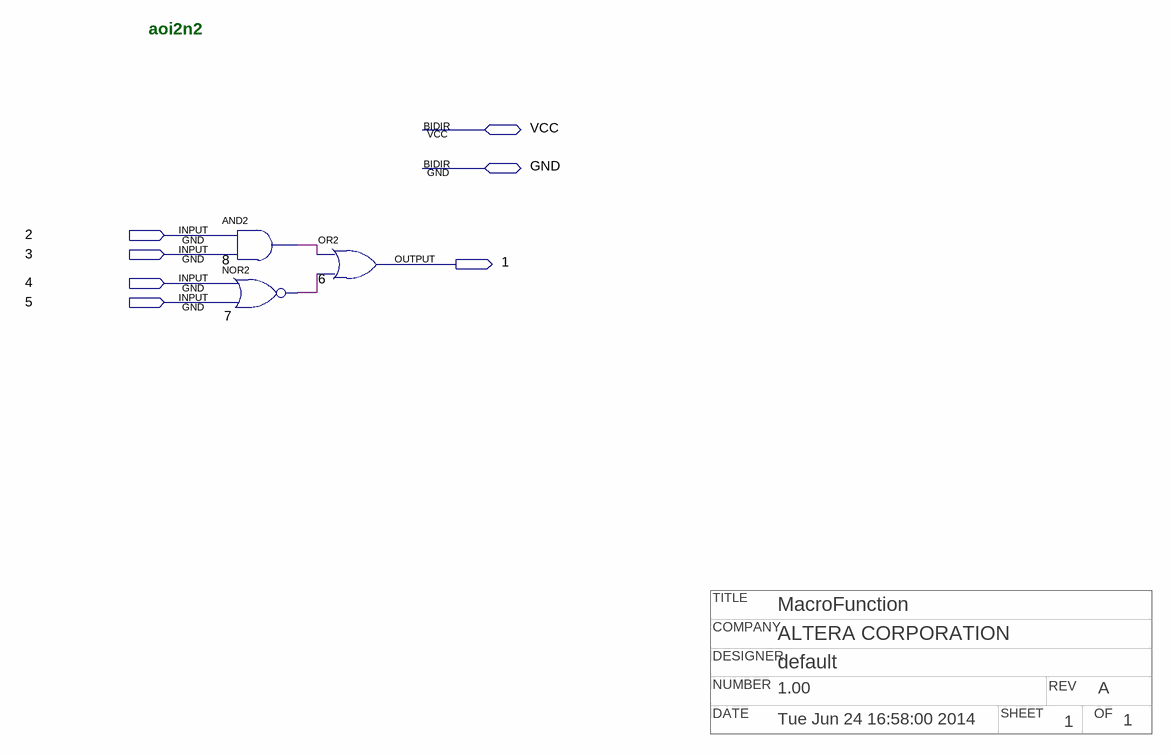
[diagram p0: schematic sheet]
// Quartus schematic npaoi2n2.bdf as structural Verilog: 3 symbols, 7 pins
// Title block: TITLE: MacroFunction; COMPANY: ALTERA CORPORATION; DESIGNER: default; NUMBER: 1.00; REV: A; DATE: Tue Jun 24 16:58:00 2014; SHEET: 1; OF: 1
module npaoi2n2 (
  input  \2 ,
  input  \3 ,
  input  \4 ,
  input  \5 ,
  inout  VCC,
  inout  GND,
  output \1 
);

  wire n7_out, n8_out;

  and u_8 (n8_out, \2 , \3 );
  nor u_7 (n7_out, \4 , \5 );
  or u_6 (\1 , n8_out, n7_out);

  // Notes on the sheet:
  //   aoi2n2
endmodule
